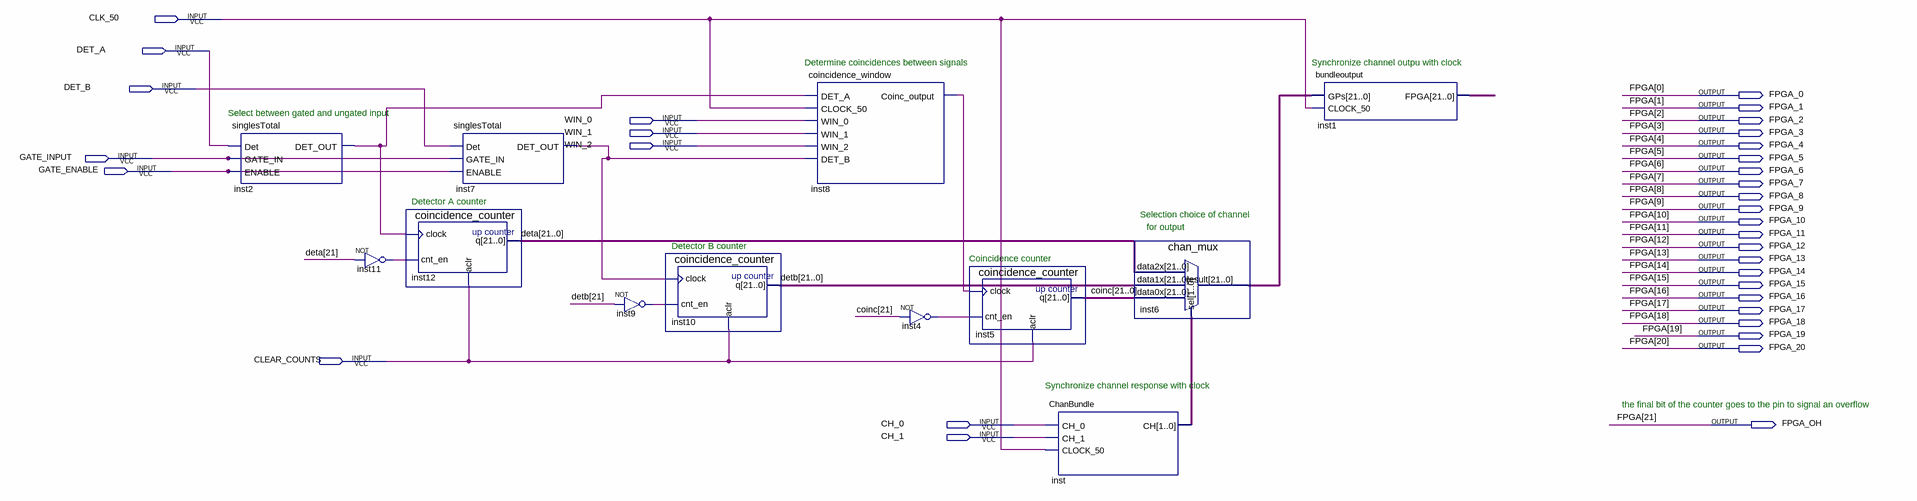
[diagram p0: schematic sheet]
// Quartus schematic coinccounter.bdf as structural Verilog: 12 symbols, 33 pins
module coinccounter (
  input  CLK_50,
  input  DET_A,
  input  DET_B,
  input  WIN_0,
  input  WIN_1,
  input  WIN_2,
  input  GATE_INPUT,
  input  GATE_ENABLE,
  input  CLEAR_COUNTS,
  input  CH_0,
  input  CH_1,
  output FPGA_0,
  output FPGA_1,
  output FPGA_2,
  output FPGA_3,
  output FPGA_4,
  output FPGA_5,
  output FPGA_6,
  output FPGA_7,
  output FPGA_8,
  output FPGA_9,
  output FPGA_10,
  output FPGA_11,
  output FPGA_12,
  output FPGA_13,
  output FPGA_14,
  output FPGA_15,
  output FPGA_16,
  output FPGA_17,
  output FPGA_18,
  output FPGA_19,
  output FPGA_20,
  output FPGA_OH
);

  wire inst2_det_out, inst4_out, inst7_det_out, inst8_coinc_output, inst9_out, inst11_out;
  wire [1:0] inst_ch;
  wire [21:0] coinc, deta, detb, inst6_result;

  singlesTotal inst2 (.Det(DET_A), .GATE_IN(GATE_INPUT), .ENABLE(GATE_ENABLE), .DET_OUT(inst2_det_out));
  not inst11 (inst11_out, deta[21]);
  coincidence_counter inst12 (.clock(inst2_det_out), .cnt_en(inst11_out), .aclr(CLEAR_COUNTS), .q(deta));
  singlesTotal inst7 (.Det(DET_B), .GATE_IN(GATE_INPUT), .ENABLE(GATE_ENABLE), .DET_OUT(inst7_det_out));
  not inst9 (inst9_out, detb[21]);
  coincidence_counter inst10 (.clock(inst7_det_out), .cnt_en(inst9_out), .aclr(CLEAR_COUNTS), .q(detb));
  coincidence_window inst8 (
    .DET_A(inst2_det_out), .CLOCK_50(CLK_50), .WIN_0(WIN_0), .WIN_1(WIN_1), .WIN_2(WIN_2),
    .DET_B(inst7_det_out), .Coinc_output(inst8_coinc_output));
  not inst4 (inst4_out, coinc[21]);
  coincidence_counter inst5 (.clock(inst8_coinc_output), .cnt_en(inst4_out), .aclr(CLEAR_COUNTS), .q(coinc));
  ChanBundle inst (.CH_0(CH_0), .CH_1(CH_1), .CLOCK_50(CLK_50), .CH(inst_ch));
  chan_mux inst6 (.data2x(deta), .data1x(detb), .data0x(coinc), .sel(inst_ch), .result(inst6_result));
  bundleoutput inst1 (
    .GPs(inst6_result), .CLOCK_50(CLK_50),
    .FPGA({FPGA_OH, FPGA_20, FPGA_19, FPGA_18, FPGA_17, FPGA_16, FPGA_15, FPGA_14, FPGA_13, FPGA_12, FPGA_11, FPGA_10, FPGA_9, FPGA_8, FPGA_7, FPGA_6, FPGA_5, FPGA_4, FPGA_3, FPGA_2, FPGA_1, FPGA_0}));

  // Other names for the same wires on the sheet: FPGA[21:0] = {FPGA_OH, FPGA_20, FPGA_19, FPGA_18, FPGA_17, FPGA_16, FPGA_15, FPGA_14, FPGA_13, FPGA_12, FPGA_11, FPGA_10, FPGA_9, FPGA_8, FPGA_7, FPGA_6, FPGA_5, FPGA_4, FPGA_3, FPGA_2, FPGA_1, FPGA_0}

  // Notes on the sheet:
  //   Determine coincidences between signals
  //   Synchronize channel outpu with clock
  //   Select between gated and ungated input
  //   Detector A counter
  //   Selection choice of channel 
  //   for output
  //   Detector B counter
  //   Coincidence counter
  //   Synchronize channel response with clock
  //   the final bit of the counter goes to the pin to signal an overflow
endmodule
